# EAGLE board Display_RevA (EAGLE 6.3), part 1 of 4
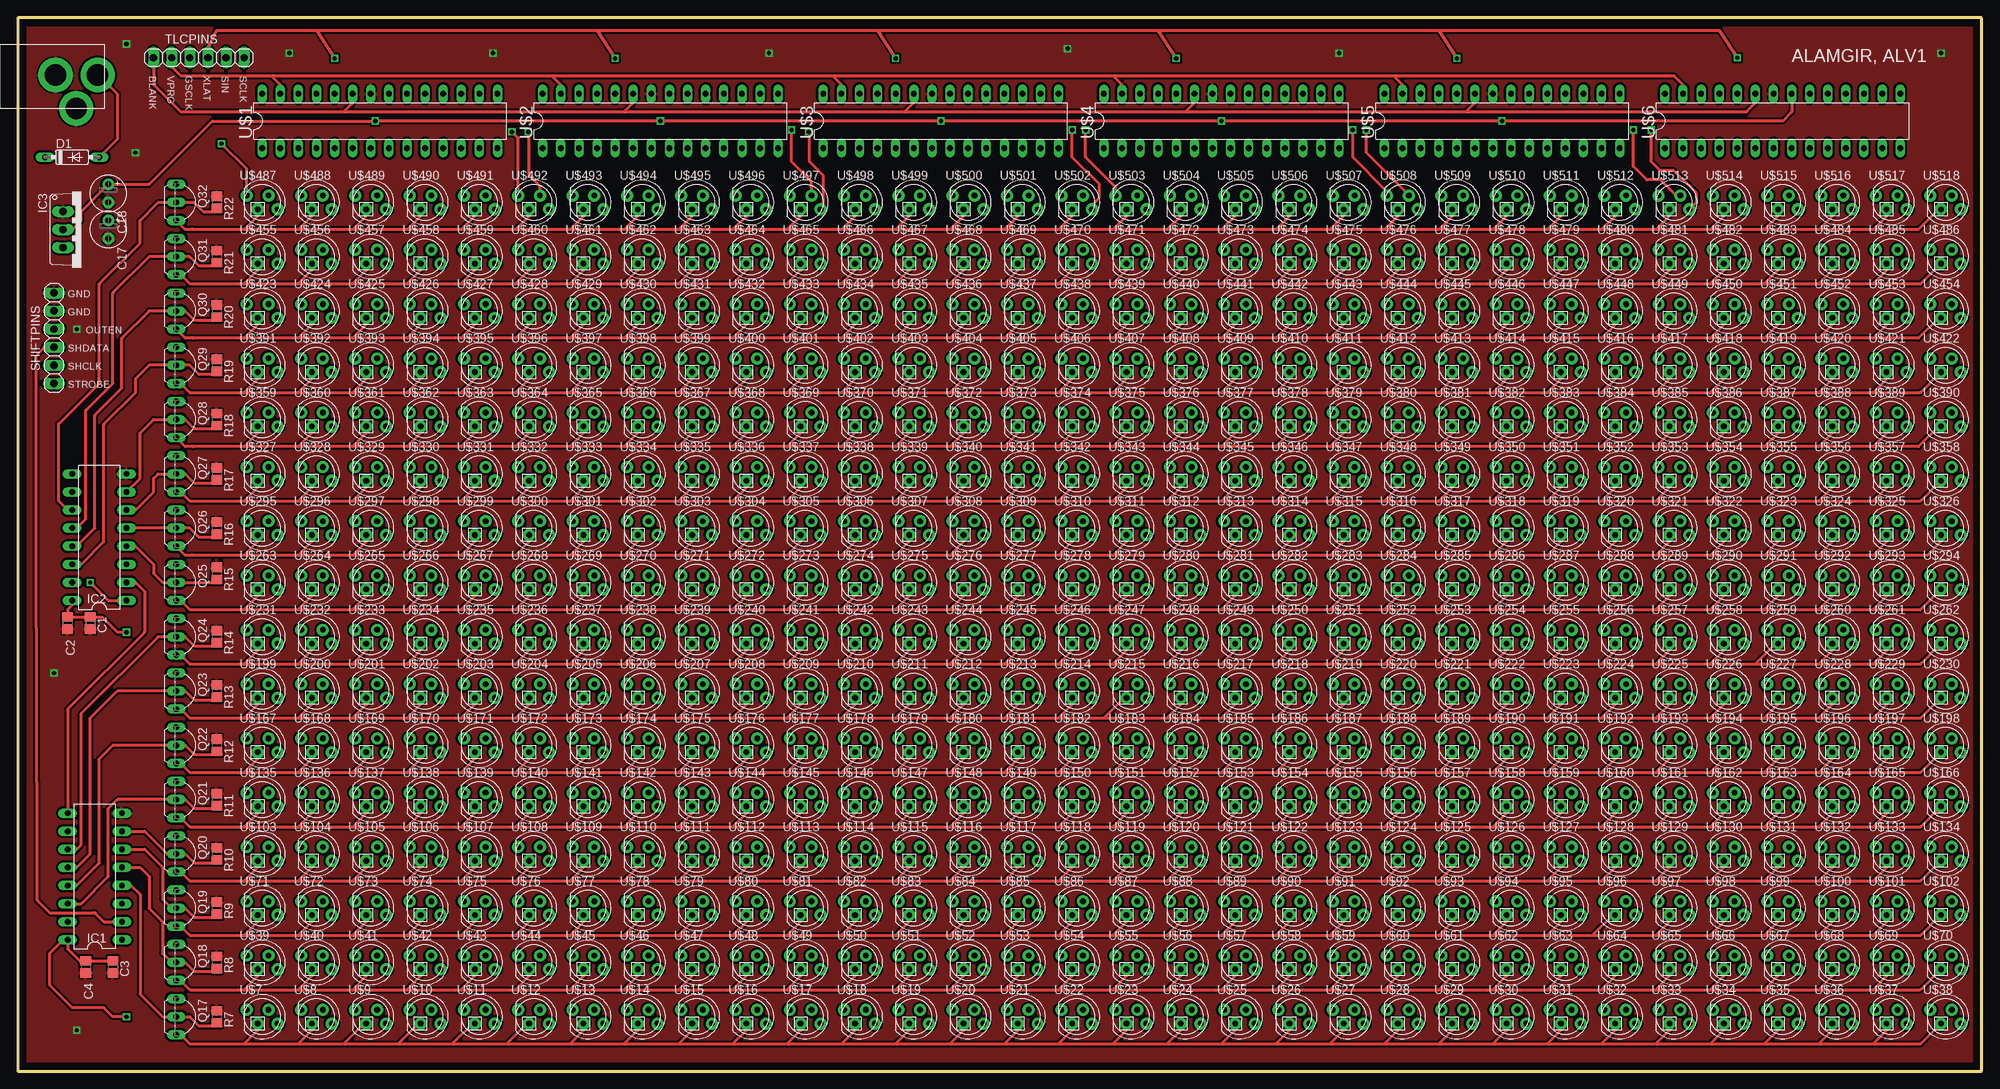
[diagram p5: board, top side]
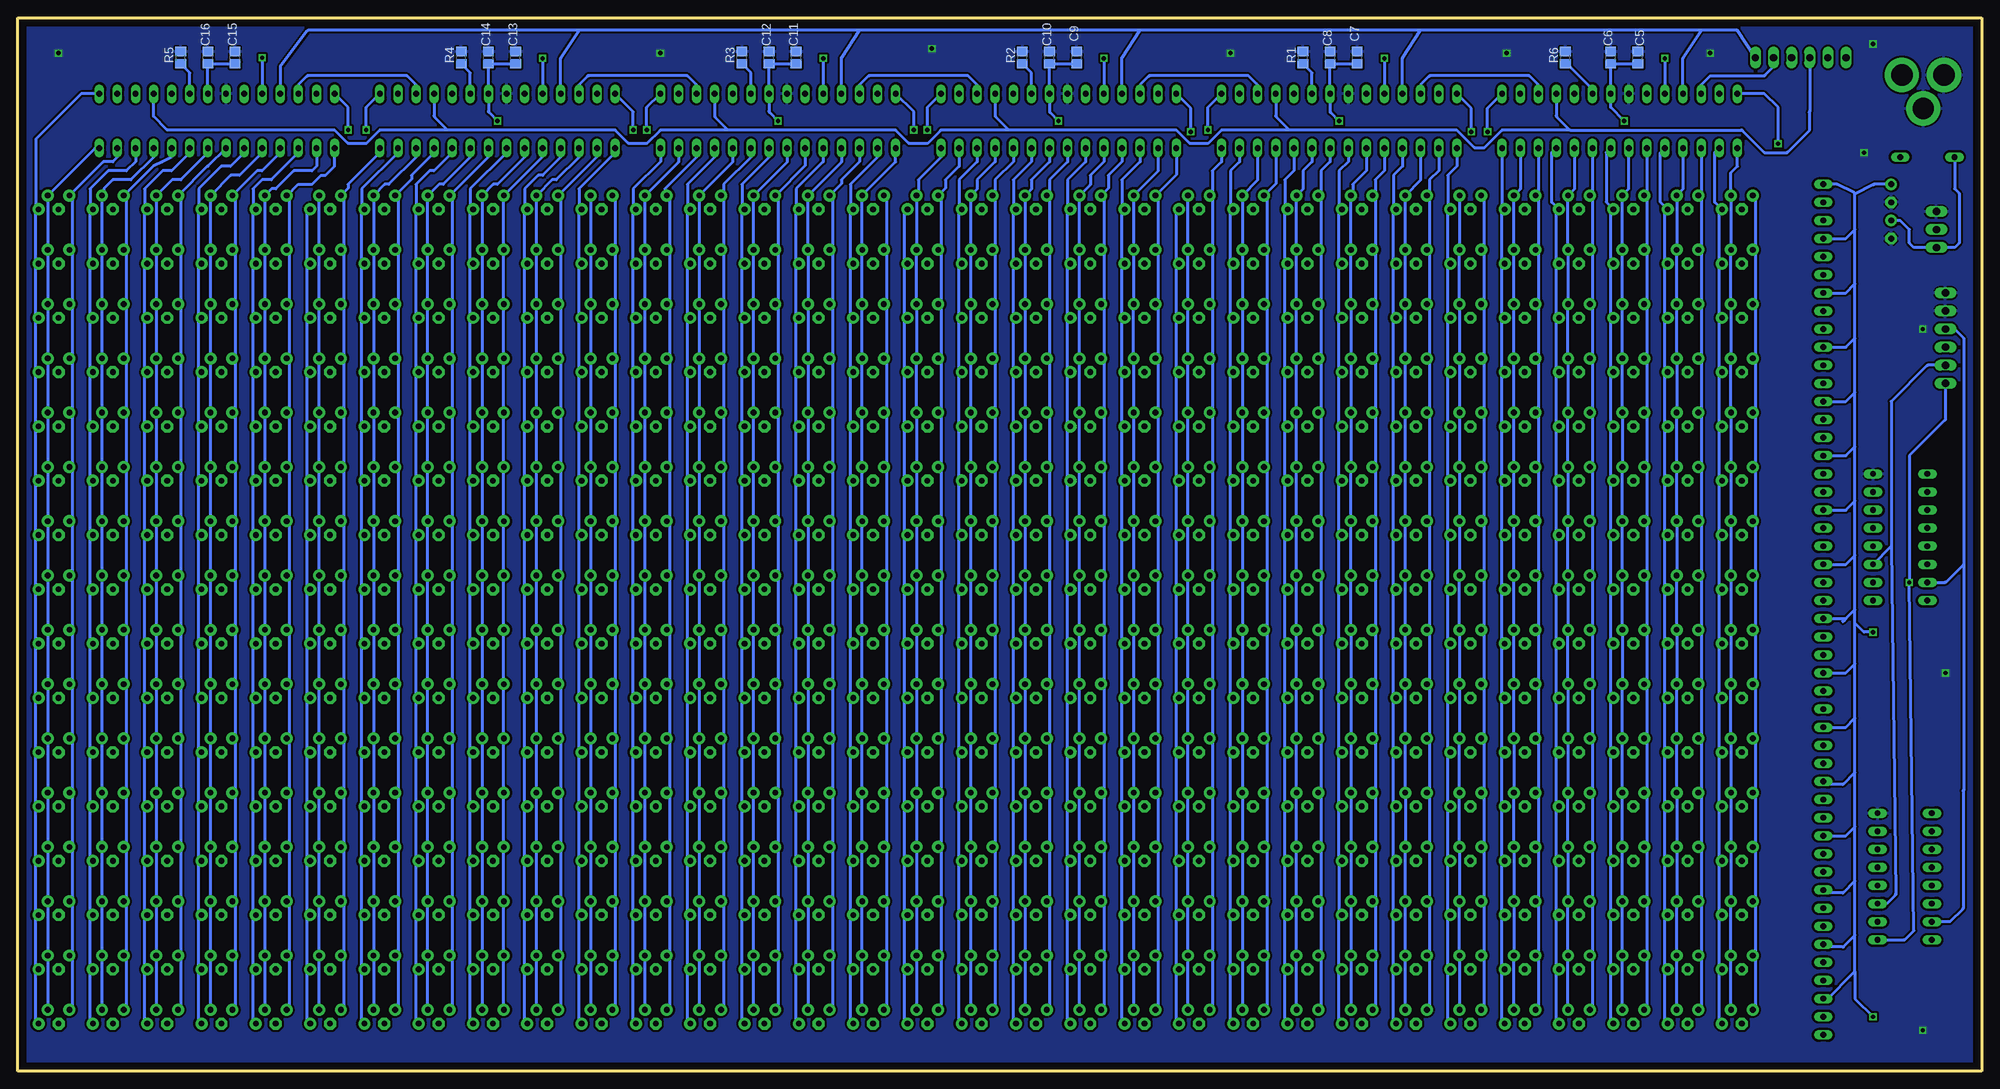
[diagram p6: board, bottom side, seen from below]

Size 275.59 x 147.83 mm. Coordinates in mm from the lower left corner, seen from the top.
Outline: 0,0 275.59,0 275.59,147.83 0,147.83 0,0
Copper layers (1*16): Top 0.035mm / dielectric 1.5mm / Bottom 0.035mm
Design rules "default": minimum track width 10mil, minimum drill 24mil, track to track 8mil, track to pad 8mil, pad to pad 8mil, via to via 8mil, smd to smd 8mil, copper to edge 40mil, drill to drill 8mil, minimum pad ring 10mil, minimum via ring 8mil, stop-mask expansion 4mil, vias tented up to drill 0mil, thermal gap 10mil
Net classes: 0 default: width 0.406 mm, drill 0.305 mm, clearance 0.305 mm

## Footprints (pad centres in the part's own frame; a part is rotated, then mirrored left to right if it is on the bottom)
C0805 = smd 1.3 x 1.5: 1 -0.85,0; 2 0.85,0
E2,5-5 = drill 0.813 pad 1.6: + -1.27,0 | drill 0.813 pad 1.6 octagon: - 1.27,0
DO35-7 = drill 0.813 long: A 3.81,0; C -3.81,0
DIL16 = drill 0.813 long: 1 -8.89,-3.81; 2 -6.35,-3.81; 3 -3.81,-3.81; 4 -1.27,-3.81; 5 1.27,-3.81; 6 3.81,-3.81; 7 6.35,-3.81; 8 8.89,-3.81; 9 8.89,3.81; 10 6.35,3.81; 11 3.81,3.81; 12 1.27,3.81; 13 -1.27,3.81; 14 -3.81,3.81; 15 -6.35,3.81; 16 -8.89,3.81
TO220V = drill 1.016 long: 1 -2.54,-2.54; 2 0,-2.54; 3 2.54,-2.54
TO92-OVAL = drill 0.813 long: 1 -2.54,0; 2 0,0; 3 2.54,0
R0805 = smd 1.3 x 1.5: 1 -0.85,0; 2 0.85,0
1X06 = drill 1.016 long: 1 -6.35,0; 2 -3.81,0; 3 -1.27,0; 4 1.27,0; 5 3.81,0; 6 6.35,0
DIL28-3 = drill 0.813 long: 1 -16.51,-3.81; 2 -13.97,-3.81; 3 -11.43,-3.81; 4 -8.89,-3.81; 5 -6.35,-3.81; 6 -3.81,-3.81; 7 -1.27,-3.81; 8 1.27,-3.81; 9 3.81,-3.81; 10 6.35,-3.81; 11 8.89,-3.81; 12 11.43,-3.81; 13 13.97,-3.81; 14 16.51,-3.81; 15 16.51,3.81; 16 13.97,3.81; 17 11.43,3.81; 18 8.89,3.81; 19 6.35,3.81; 20 3.81,3.81; 21 1.27,3.81; 22 -1.27,3.81; 23 -3.81,3.81; 24 -6.35,3.81; 25 -8.89,3.81; 26 -11.43,3.81; 27 -13.97,3.81; 28 -16.51,3.81
LED5MMRGB = drill 0.8 pad 1.676: 1 -2.159,0.968; 3 0.889,0.968; 4 2.159,-0.968 | drill 0.8 pad 1.676 octagon: 2 -0.635,-0.968
PJ-102A = drill 3 pad 4.8: RING 0.1,-3.39; RING_SW -4.6,-6.29; TIP 0.1,-9.29

## Placement (x,y rotation side)
C1  1u  [C0805]  10.16,62.86 270 top
C2  0.1u  [C0805]  6.98,62.86 270 top
C3  1u  [C0805]  13.33,14.61 270 top
C4  0.1u  [C0805]  9.53,14.61 270 top
C5  1u  [C0805]  48.26,142.24 90 bottom
C6  0.1u  [C0805]  52.07,142.24 90 bottom
C7  1u  [C0805]  87.63,142.24 90 bottom
C8  0.1u  [C0805]  91.44,142.24 90 bottom
C9  1u  [C0805]  127,142.24 90 bottom
C10  0.1u  [C0805]  130.81,142.24 90 bottom
C11  1u  [C0805]  166.37,142.24 90 bottom
C12  0.1u  [C0805]  170.18,142.24 90 bottom
C13  1u  [C0805]  205.74,142.24 90 bottom
C14  0.1u  [C0805]  209.55,142.24 90 bottom
C15  1u  [C0805]  245.11,142.24 90 bottom
C16  0.1u  [C0805]  248.92,142.24 90 bottom
C17  [E2,5-5]  12.7,118.11 270 top
C18  [E2,5-5]  12.7,123.19 270 top
D1  1N4148DO35-7  [DO35-7]  7.62,128.27 0 top
IC1  4094N  [DIL16]  10.79,27.3 90 top
IC2  4094N  [DIL16]  11.43,74.93 90 top
IC3  MC33269T-5.0  [TO220V]  8.89,118.11 270 top
Q17  PFETZVP3306  [TO92-OVAL]  22.22,7.62 270 top
Q18  PFETZVP3306  [TO92-OVAL]  22.22,15.24 270 top
Q19  PFETZVP3306  [TO92-OVAL]  22.22,22.86 270 top
Q20  PFETZVP3306  [TO92-OVAL]  22.22,30.48 270 top
Q21  PFETZVP3306  [TO92-OVAL]  22.22,38.1 270 top
Q22  PFETZVP3306  [TO92-OVAL]  22.22,45.72 270 top
Q23  PFETZVP3306  [TO92-OVAL]  22.22,53.34 270 top
Q24  PFETZVP3306  [TO92-OVAL]  22.22,60.96 270 top
Q25  PFETZVP3306  [TO92-OVAL]  22.22,68.58 270 top
Q26  PFETZVP3306  [TO92-OVAL]  22.22,76.2 270 top
Q27  PFETZVP3306  [TO92-OVAL]  22.22,83.82 270 top
Q28  PFETZVP3306  [TO92-OVAL]  22.22,91.44 270 top
Q29  PFETZVP3306  [TO92-OVAL]  22.22,99.06 270 top
Q30  PFETZVP3306  [TO92-OVAL]  22.22,106.68 270 top
Q31  PFETZVP3306  [TO92-OVAL]  22.22,114.3 270 top
Q32  PFETZVP3306  [TO92-OVAL]  22.22,121.92 270 top
R1  2.2k  [R0805]  95.25,142.24 90 bottom
R2  2.2k  [R0805]  134.62,142.24 90 bottom
R3  2.2k  [R0805]  173.99,142.24 90 bottom
R4  2.2k  [R0805]  213.36,142.24 90 bottom
R5  2.2k  [R0805]  252.73,142.24 90 bottom
R6  2.2k  [R0805]  58.42,142.24 90 bottom
R7  1k  [R0805]  27.94,7.62 270 top
R8  1k  [R0805]  27.94,15.24 270 top
R9  1k  [R0805]  27.94,22.86 270 top
R10  1k  [R0805]  27.94,30.48 270 top
R11  1k  [R0805]  27.94,38.1 270 top
R12  1k  [R0805]  27.94,45.72 270 top
R13  1k  [R0805]  27.94,53.34 270 top
R14  1k  [R0805]  27.94,60.96 270 top
R15  1k  [R0805]  27.94,69.85 270 top
R16  1k  [R0805]  27.94,76.2 270 top
R17  1k  [R0805]  27.94,83.82 270 top
R18  1k  [R0805]  27.94,91.44 270 top
R19  1k  [R0805]  27.94,99.06 270 top
R20  1k  [R0805]  27.94,106.68 270 top
R21  1k  [R0805]  27.94,114.3 270 top
R22  1k  [R0805]  27.94,121.92 270 top
SHIFTPINS  [1X06]  5.08,102.87 270 top
TLCPINS  [1X06]  25.4,142.24 180 top
U$1  TLC5940  [DIL28-3]  50.8,133.35 0 top
U$2  TLC5940  [DIL28-3]  90.17,133.35 0 top
U$3  TLC5940  [DIL28-3]  129.54,133.35 0 top
U$4  TLC5940  [DIL28-3]  168.91,133.35 0 top
U$5  TLC5940  [DIL28-3]  208.28,133.35 0 top
U$6  TLC5940  [DIL28-3]  247.65,133.35 0 top
U$7  RGBLEDAN  [LED5MMRGB]  34.29,7.62 0 top
U$8  RGBLEDAN  [LED5MMRGB]  41.91,7.62 0 top
U$9  RGBLEDAN  [LED5MMRGB]  49.53,7.62 0 top
U$10  RGBLEDAN  [LED5MMRGB]  57.15,7.62 0 top
U$11  RGBLEDAN  [LED5MMRGB]  64.77,7.62 0 top
U$12  RGBLEDAN  [LED5MMRGB]  72.39,7.62 0 top
U$13  RGBLEDAN  [LED5MMRGB]  80.01,7.62 0 top
U$14  RGBLEDAN  [LED5MMRGB]  87.63,7.62 0 top
U$15  RGBLEDAN  [LED5MMRGB]  95.25,7.62 0 top
U$16  RGBLEDAN  [LED5MMRGB]  102.87,7.62 0 top
U$17  RGBLEDAN  [LED5MMRGB]  110.49,7.62 0 top
U$18  RGBLEDAN  [LED5MMRGB]  118.11,7.62 0 top
U$19  RGBLEDAN  [LED5MMRGB]  125.73,7.62 0 top
U$20  RGBLEDAN  [LED5MMRGB]  133.35,7.62 0 top
U$21  RGBLEDAN  [LED5MMRGB]  140.97,7.62 0 top
U$22  RGBLEDAN  [LED5MMRGB]  148.59,7.62 0 top
U$23  RGBLEDAN  [LED5MMRGB]  156.21,7.62 0 top
U$24  RGBLEDAN  [LED5MMRGB]  163.83,7.62 0 top
U$25  RGBLEDAN  [LED5MMRGB]  171.45,7.62 0 top
U$26  RGBLEDAN  [LED5MMRGB]  179.07,7.62 0 top
U$27  RGBLEDAN  [LED5MMRGB]  186.69,7.62 0 top
U$28  RGBLEDAN  [LED5MMRGB]  194.31,7.62 0 top
U$29  RGBLEDAN  [LED5MMRGB]  201.93,7.62 0 top
U$30  RGBLEDAN  [LED5MMRGB]  209.55,7.62 0 top
U$31  RGBLEDAN  [LED5MMRGB]  217.17,7.62 0 top
U$32  RGBLEDAN  [LED5MMRGB]  224.79,7.62 0 top
U$33  RGBLEDAN  [LED5MMRGB]  232.41,7.62 0 top
U$34  RGBLEDAN  [LED5MMRGB]  240.03,7.62 0 top
U$35  RGBLEDAN  [LED5MMRGB]  247.65,7.62 0 top
U$36  RGBLEDAN  [LED5MMRGB]  255.27,7.62 0 top
U$37  RGBLEDAN  [LED5MMRGB]  262.89,7.62 0 top
U$38  RGBLEDAN  [LED5MMRGB]  270.51,7.62 0 top
U$39  RGBLEDAN  [LED5MMRGB]  34.29,15.24 0 top
U$40  RGBLEDAN  [LED5MMRGB]  41.91,15.24 0 top
U$41  RGBLEDAN  [LED5MMRGB]  49.53,15.24 0 top
U$42  RGBLEDAN  [LED5MMRGB]  57.15,15.24 0 top
U$43  RGBLEDAN  [LED5MMRGB]  64.77,15.24 0 top
U$44  RGBLEDAN  [LED5MMRGB]  72.39,15.24 0 top
U$45  RGBLEDAN  [LED5MMRGB]  80.01,15.24 0 top
U$46  RGBLEDAN  [LED5MMRGB]  87.63,15.24 0 top
U$47  RGBLEDAN  [LED5MMRGB]  95.25,15.24 0 top
U$48  RGBLEDAN  [LED5MMRGB]  102.87,15.24 0 top
U$49  RGBLEDAN  [LED5MMRGB]  110.49,15.24 0 top
U$50  RGBLEDAN  [LED5MMRGB]  118.11,15.24 0 top
U$51  RGBLEDAN  [LED5MMRGB]  125.73,15.24 0 top
U$52  RGBLEDAN  [LED5MMRGB]  133.35,15.24 0 top
U$53  RGBLEDAN  [LED5MMRGB]  140.97,15.24 0 top
U$54  RGBLEDAN  [LED5MMRGB]  148.59,15.24 0 top
U$55  RGBLEDAN  [LED5MMRGB]  156.21,15.24 0 top
U$56  RGBLEDAN  [LED5MMRGB]  163.83,15.24 0 top
U$57  RGBLEDAN  [LED5MMRGB]  171.45,15.24 0 top
U$58  RGBLEDAN  [LED5MMRGB]  179.07,15.24 0 top
U$59  RGBLEDAN  [LED5MMRGB]  186.69,15.24 0 top
U$60  RGBLEDAN  [LED5MMRGB]  194.31,15.24 0 top
U$61  RGBLEDAN  [LED5MMRGB]  201.93,15.24 0 top
U$62  RGBLEDAN  [LED5MMRGB]  209.55,15.24 0 top
U$63  RGBLEDAN  [LED5MMRGB]  217.17,15.24 0 top
U$64  RGBLEDAN  [LED5MMRGB]  224.79,15.24 0 top
U$65  RGBLEDAN  [LED5MMRGB]  232.41,15.24 0 top
U$66  RGBLEDAN  [LED5MMRGB]  240.03,15.24 0 top
U$67  RGBLEDAN  [LED5MMRGB]  247.65,15.24 0 top
U$68  RGBLEDAN  [LED5MMRGB]  255.27,15.24 0 top
U$69  RGBLEDAN  [LED5MMRGB]  262.89,15.24 0 top
U$70  RGBLEDAN  [LED5MMRGB]  270.51,15.24 0 top
U$71  RGBLEDAN  [LED5MMRGB]  34.29,22.86 0 top
U$72  RGBLEDAN  [LED5MMRGB]  41.91,22.86 0 top
U$73  RGBLEDAN  [LED5MMRGB]  49.53,22.86 0 top
U$74  RGBLEDAN  [LED5MMRGB]  57.15,22.86 0 top
U$75  RGBLEDAN  [LED5MMRGB]  64.77,22.86 0 top
U$76  RGBLEDAN  [LED5MMRGB]  72.39,22.86 0 top
U$77  RGBLEDAN  [LED5MMRGB]  80.01,22.86 0 top
U$78  RGBLEDAN  [LED5MMRGB]  87.63,22.86 0 top
U$79  RGBLEDAN  [LED5MMRGB]  95.25,22.86 0 top
U$80  RGBLEDAN  [LED5MMRGB]  102.87,22.86 0 top
U$81  RGBLEDAN  [LED5MMRGB]  110.49,22.86 0 top
U$82  RGBLEDAN  [LED5MMRGB]  118.11,22.86 0 top
U$83  RGBLEDAN  [LED5MMRGB]  125.73,22.86 0 top
U$84  RGBLEDAN  [LED5MMRGB]  133.35,22.86 0 top
U$85  RGBLEDAN  [LED5MMRGB]  140.97,22.86 0 top
U$86  RGBLEDAN  [LED5MMRGB]  148.59,22.86 0 top
U$87  RGBLEDAN  [LED5MMRGB]  156.21,22.86 0 top
U$88  RGBLEDAN  [LED5MMRGB]  163.83,22.86 0 top
U$89  RGBLEDAN  [LED5MMRGB]  171.45,22.86 0 top
U$90  RGBLEDAN  [LED5MMRGB]  179.07,22.86 0 top
U$91  RGBLEDAN  [LED5MMRGB]  186.69,22.86 0 top
U$92  RGBLEDAN  [LED5MMRGB]  194.31,22.86 0 top
U$93  RGBLEDAN  [LED5MMRGB]  201.93,22.86 0 top
U$94  RGBLEDAN  [LED5MMRGB]  209.55,22.86 0 top
U$95  RGBLEDAN  [LED5MMRGB]  217.17,22.86 0 top
U$96  RGBLEDAN  [LED5MMRGB]  224.79,22.86 0 top
U$97  RGBLEDAN  [LED5MMRGB]  232.41,22.86 0 top
U$98  RGBLEDAN  [LED5MMRGB]  240.03,22.86 0 top
U$99  RGBLEDAN  [LED5MMRGB]  247.65,22.86 0 top
U$100  RGBLEDAN  [LED5MMRGB]  255.27,22.86 0 top
U$101  RGBLEDAN  [LED5MMRGB]  262.89,22.86 0 top
U$102  RGBLEDAN  [LED5MMRGB]  270.51,22.86 0 top
U$103  RGBLEDAN  [LED5MMRGB]  34.29,30.48 0 top
U$104  RGBLEDAN  [LED5MMRGB]  41.91,30.48 0 top
U$105  RGBLEDAN  [LED5MMRGB]  49.53,30.48 0 top
U$106  RGBLEDAN  [LED5MMRGB]  57.15,30.48 0 top
U$107  RGBLEDAN  [LED5MMRGB]  64.77,30.48 0 top
U$108  RGBLEDAN  [LED5MMRGB]  72.39,30.48 0 top
U$109  RGBLEDAN  [LED5MMRGB]  80.01,30.48 0 top
U$110  RGBLEDAN  [LED5MMRGB]  87.63,30.48 0 top
U$111  RGBLEDAN  [LED5MMRGB]  95.25,30.48 0 top
U$112  RGBLEDAN  [LED5MMRGB]  102.87,30.48 0 top
U$113  RGBLEDAN  [LED5MMRGB]  110.49,30.48 0 top
U$114  RGBLEDAN  [LED5MMRGB]  118.11,30.48 0 top
U$115  RGBLEDAN  [LED5MMRGB]  125.73,30.48 0 top
U$116  RGBLEDAN  [LED5MMRGB]  133.35,30.48 0 top
U$117  RGBLEDAN  [LED5MMRGB]  140.97,30.48 0 top
U$118  RGBLEDAN  [LED5MMRGB]  148.59,30.48 0 top
U$119  RGBLEDAN  [LED5MMRGB]  156.21,30.48 0 top
U$120  RGBLEDAN  [LED5MMRGB]  163.83,30.48 0 top
U$121  RGBLEDAN  [LED5MMRGB]  171.45,30.48 0 top
U$122  RGBLEDAN  [LED5MMRGB]  179.07,30.48 0 top
U$123  RGBLEDAN  [LED5MMRGB]  186.69,30.48 0 top
U$124  RGBLEDAN  [LED5MMRGB]  194.31,30.48 0 top
U$125  RGBLEDAN  [LED5MMRGB]  201.93,30.48 0 top
U$126  RGBLEDAN  [LED5MMRGB]  209.55,30.48 0 top
U$127  RGBLEDAN  [LED5MMRGB]  217.17,30.48 0 top
U$128  RGBLEDAN  [LED5MMRGB]  224.79,30.48 0 top
U$129  RGBLEDAN  [LED5MMRGB]  232.41,30.48 0 top
U$130  RGBLEDAN  [LED5MMRGB]  240.03,30.48 0 top
U$131  RGBLEDAN  [LED5MMRGB]  247.65,30.48 0 top
U$132  RGBLEDAN  [LED5MMRGB]  255.27,30.48 0 top
U$133  RGBLEDAN  [LED5MMRGB]  262.89,30.48 0 top
U$134  RGBLEDAN  [LED5MMRGB]  270.51,30.48 0 top
U$135  RGBLEDAN  [LED5MMRGB]  34.29,38.1 0 top
U$136  RGBLEDAN  [LED5MMRGB]  41.91,38.1 0 top
U$137  RGBLEDAN  [LED5MMRGB]  49.53,38.1 0 top
U$138  RGBLEDAN  [LED5MMRGB]  57.15,38.1 0 top
U$139  RGBLEDAN  [LED5MMRGB]  64.77,38.1 0 top
U$140  RGBLEDAN  [LED5MMRGB]  72.39,38.1 0 top
U$141  RGBLEDAN  [LED5MMRGB]  80.01,38.1 0 top
U$142  RGBLEDAN  [LED5MMRGB]  87.63,38.1 0 top
U$143  RGBLEDAN  [LED5MMRGB]  95.25,38.1 0 top
U$144  RGBLEDAN  [LED5MMRGB]  102.87,38.1 0 top
U$145  RGBLEDAN  [LED5MMRGB]  110.49,38.1 0 top
U$146  RGBLEDAN  [LED5MMRGB]  118.11,38.1 0 top
U$147  RGBLEDAN  [LED5MMRGB]  125.73,38.1 0 top
U$148  RGBLEDAN  [LED5MMRGB]  133.35,38.1 0 top
U$149  RGBLEDAN  [LED5MMRGB]  140.97,38.1 0 top
U$150  RGBLEDAN  [LED5MMRGB]  148.59,38.1 0 top
U$151  RGBLEDAN  [LED5MMRGB]  156.21,38.1 0 top
U$152  RGBLEDAN  [LED5MMRGB]  163.83,38.1 0 top
U$153  RGBLEDAN  [LED5MMRGB]  171.45,38.1 0 top
U$154  RGBLEDAN  [LED5MMRGB]  179.07,38.1 0 top
U$155  RGBLEDAN  [LED5MMRGB]  186.69,38.1 0 top
U$156  RGBLEDAN  [LED5MMRGB]  194.31,38.1 0 top
U$157  RGBLEDAN  [LED5MMRGB]  201.93,38.1 0 top
U$158  RGBLEDAN  [LED5MMRGB]  209.55,38.1 0 top
U$159  RGBLEDAN  [LED5MMRGB]  217.17,38.1 0 top
U$160  RGBLEDAN  [LED5MMRGB]  224.79,38.1 0 top
U$161  RGBLEDAN  [LED5MMRGB]  232.41,38.1 0 top
U$162  RGBLEDAN  [LED5MMRGB]  240.03,38.1 0 top
U$163  RGBLEDAN  [LED5MMRGB]  247.65,38.1 0 top
U$164  RGBLEDAN  [LED5MMRGB]  255.27,38.1 0 top
U$165  RGBLEDAN  [LED5MMRGB]  262.89,38.1 0 top
U$166  RGBLEDAN  [LED5MMRGB]  270.51,38.1 0 top
U$167  RGBLEDAN  [LED5MMRGB]  34.29,45.72 0 top
U$168  RGBLEDAN  [LED5MMRGB]  41.91,45.72 0 top
U$169  RGBLEDAN  [LED5MMRGB]  49.53,45.72 0 top
U$170  RGBLEDAN  [LED5MMRGB]  57.15,45.72 0 top
U$171  RGBLEDAN  [LED5MMRGB]  64.77,45.72 0 top
U$172  RGBLEDAN  [LED5MMRGB]  72.39,45.72 0 top
U$173  RGBLEDAN  [LED5MMRGB]  80.01,45.72 0 top
U$174  RGBLEDAN  [LED5MMRGB]  87.63,45.72 0 top
U$175  RGBLEDAN  [LED5MMRGB]  95.25,45.72 0 top
U$176  RGBLEDAN  [LED5MMRGB]  102.87,45.72 0 top
U$177  RGBLEDAN  [LED5MMRGB]  110.49,45.72 0 top
U$178  RGBLEDAN  [LED5MMRGB]  118.11,45.72 0 top
U$179  RGBLEDAN  [LED5MMRGB]  125.73,45.72 0 top
U$180  RGBLEDAN  [LED5MMRGB]  133.35,45.72 0 top
U$181  RGBLEDAN  [LED5MMRGB]  140.97,45.72 0 top
U$182  RGBLEDAN  [LED5MMRGB]  148.59,45.72 0 top
U$183  RGBLEDAN  [LED5MMRGB]  156.21,45.72 0 top
U$184  RGBLEDAN  [LED5MMRGB]  163.83,45.72 0 top
U$185  RGBLEDAN  [LED5MMRGB]  171.45,45.72 0 top
U$186  RGBLEDAN  [LED5MMRGB]  179.07,45.72 0 top
U$187  RGBLEDAN  [LED5MMRGB]  186.69,45.72 0 top
U$188  RGBLEDAN  [LED5MMRGB]  194.31,45.72 0 top
U$189  RGBLEDAN  [LED5MMRGB]  201.93,45.72 0 top
U$190  RGBLEDAN  [LED5MMRGB]  209.55,45.72 0 top
U$191  RGBLEDAN  [LED5MMRGB]  217.17,45.72 0 top
U$192  RGBLEDAN  [LED5MMRGB]  224.79,45.72 0 top
U$193  RGBLEDAN  [LED5MMRGB]  232.41,45.72 0 top
U$194  RGBLEDAN  [LED5MMRGB]  240.03,45.72 0 top
U$195  RGBLEDAN  [LED5MMRGB]  247.65,45.72 0 top
U$196  RGBLEDAN  [LED5MMRGB]  255.27,45.72 0 top
U$197  RGBLEDAN  [LED5MMRGB]  262.89,45.72 0 top
U$198  RGBLEDAN  [LED5MMRGB]  270.51,45.72 0 top
U$199  RGBLEDAN  [LED5MMRGB]  34.29,53.34 0 top
U$200  RGBLEDAN  [LED5MMRGB]  41.91,53.34 0 top
U$201  RGBLEDAN  [LED5MMRGB]  49.53,53.34 0 top
U$202  RGBLEDAN  [LED5MMRGB]  57.15,53.34 0 top
U$203  RGBLEDAN  [LED5MMRGB]  64.77,53.34 0 top
U$204  RGBLEDAN  [LED5MMRGB]  72.39,53.34 0 top
U$205  RGBLEDAN  [LED5MMRGB]  80.01,53.34 0 top
U$206  RGBLEDAN  [LED5MMRGB]  87.63,53.34 0 top
U$207  RGBLEDAN  [LED5MMRGB]  95.25,53.34 0 top
U$208  RGBLEDAN  [LED5MMRGB]  102.87,53.34 0 top
U$209  RGBLEDAN  [LED5MMRGB]  110.49,53.34 0 top
U$210  RGBLEDAN  [LED5MMRGB]  118.11,53.34 0 top
U$211  RGBLEDAN  [LED5MMRGB]  125.73,53.34 0 top
U$212  RGBLEDAN  [LED5MMRGB]  133.35,53.34 0 top
U$213  RGBLEDAN  [LED5MMRGB]  140.97,53.34 0 top
U$214  RGBLEDAN  [LED5MMRGB]  148.59,53.34 0 top
U$215  RGBLEDAN  [LED5MMRGB]  156.21,53.34 0 top
U$216  RGBLEDAN  [LED5MMRGB]  163.83,53.34 0 top
U$217  RGBLEDAN  [LED5MMRGB]  171.45,53.34 0 top
U$218  RGBLEDAN  [LED5MMRGB]  179.07,53.34 0 top
U$219  RGBLEDAN  [LED5MMRGB]  186.69,53.34 0 top
U$220  RGBLEDAN  [LED5MMRGB]  194.31,53.34 0 top
U$221  RGBLEDAN  [LED5MMRGB]  201.93,53.34 0 top
U$222  RGBLEDAN  [LED5MMRGB]  209.55,53.34 0 top
U$223  RGBLEDAN  [LED5MMRGB]  217.17,53.34 0 top
U$224  RGBLEDAN  [LED5MMRGB]  224.79,53.34 0 top
U$225  RGBLEDAN  [LED5MMRGB]  232.41,53.34 0 top
U$226  RGBLEDAN  [LED5MMRGB]  240.03,53.34 0 top
U$227  RGBLEDAN  [LED5MMRGB]  247.65,53.34 0 top
U$228  RGBLEDAN  [LED5MMRGB]  255.27,53.34 0 top
U$229  RGBLEDAN  [LED5MMRGB]  262.89,53.34 0 top
U$230  RGBLEDAN  [LED5MMRGB]  270.51,53.34 0 top
U$231  RGBLEDAN  [LED5MMRGB]  34.29,60.96 0 top
U$232  RGBLEDAN  [LED5MMRGB]  41.91,60.96 0 top
U$233  RGBLEDAN  [LED5MMRGB]  49.53,60.96 0 top
U$234  RGBLEDAN  [LED5MMRGB]  57.15,60.96 0 top
U$235  RGBLEDAN  [LED5MMRGB]  64.77,60.96 0 top
U$236  RGBLEDAN  [LED5MMRGB]  72.39,60.96 0 top
U$237  RGBLEDAN  [LED5MMRGB]  80.01,60.96 0 top
U$238  RGBLEDAN  [LED5MMRGB]  87.63,60.96 0 top
U$239  RGBLEDAN  [LED5MMRGB]  95.25,60.96 0 top
U$240  RGBLEDAN  [LED5MMRGB]  102.87,60.96 0 top
U$241  RGBLEDAN  [LED5MMRGB]  110.49,60.96 0 top
U$242  RGBLEDAN  [LED5MMRGB]  118.11,60.96 0 top
U$243  RGBLEDAN  [LED5MMRGB]  125.73,60.96 0 top
U$244  RGBLEDAN  [LED5MMRGB]  133.35,60.96 0 top
U$245  RGBLEDAN  [LED5MMRGB]  140.97,60.96 0 top
U$246  RGBLEDAN  [LED5MMRGB]  148.59,60.96 0 top
U$247  RGBLEDAN  [LED5MMRGB]  156.21,60.96 0 top
U$248  RGBLEDAN  [LED5MMRGB]  163.83,60.96 0 top
U$249  RGBLEDAN  [LED5MMRGB]  171.45,60.96 0 top
U$250  RGBLEDAN  [LED5MMRGB]  179.07,60.96 0 top
U$251  RGBLEDAN  [LED5MMRGB]  186.69,60.96 0 top
U$252  RGBLEDAN  [LED5MMRGB]  194.31,60.96 0 top
U$253  RGBLEDAN  [LED5MMRGB]  201.93,60.96 0 top
U$254  RGBLEDAN  [LED5MMRGB]  209.55,60.96 0 top
U$255  RGBLEDAN  [LED5MMRGB]  217.17,60.96 0 top
U$256  RGBLEDAN  [LED5MMRGB]  224.79,60.96 0 top
U$257  RGBLEDAN  [LED5MMRGB]  232.41,60.96 0 top
U$258  RGBLEDAN  [LED5MMRGB]  240.03,60.96 0 top
U$259  RGBLEDAN  [LED5MMRGB]  247.65,60.96 0 top
U$260  RGBLEDAN  [LED5MMRGB]  255.27,60.96 0 top
U$261  RGBLEDAN  [LED5MMRGB]  262.89,60.96 0 top
U$262  RGBLEDAN  [LED5MMRGB]  270.51,60.96 0 top
U$263  RGBLEDAN  [LED5MMRGB]  34.29,68.58 0 top
U$264  RGBLEDAN  [LED5MMRGB]  41.91,68.58 0 top
U$265  RGBLEDAN  [LED5MMRGB]  49.53,68.58 0 top
U$266  RGBLEDAN  [LED5MMRGB]  57.15,68.58 0 top
U$267  RGBLEDAN  [LED5MMRGB]  64.77,68.58 0 top
U$268  RGBLEDAN  [LED5MMRGB]  72.39,68.58 0 top
U$269  RGBLEDAN  [LED5MMRGB]  80.01,68.58 0 top
U$270  RGBLEDAN  [LED5MMRGB]  87.63,68.58 0 top
U$271  RGBLEDAN  [LED5MMRGB]  95.25,68.58 0 top
U$272  RGBLEDAN  [LED5MMRGB]  102.87,68.58 0 top
U$273  RGBLEDAN  [LED5MMRGB]  110.49,68.58 0 top
U$274  RGBLEDAN  [LED5MMRGB]  118.11,68.58 0 top
U$275  RGBLEDAN  [LED5MMRGB]  125.73,68.58 0 top
U$276  RGBLEDAN  [LED5MMRGB]  133.35,68.58 0 top
U$277  RGBLEDAN  [LED5MMRGB]  140.97,68.58 0 top
U$278  RGBLEDAN  [LED5MMRGB]  148.59,68.58 0 top
U$279  RGBLEDAN  [LED5MMRGB]  156.21,68.58 0 top
U$280  RGBLEDAN  [LED5MMRGB]  163.83,68.58 0 top
U$281  RGBLEDAN  [LED5MMRGB]  171.45,68.58 0 top
U$282  RGBLEDAN  [LED5MMRGB]  179.07,68.58 0 top
U$283  RGBLEDAN  [LED5MMRGB]  186.69,68.58 0 top
U$284  RGBLEDAN  [LED5MMRGB]  194.31,68.58 0 top
U$285  RGBLEDAN  [LED5MMRGB]  201.93,68.58 0 top
U$286  RGBLEDAN  [LED5MMRGB]  209.55,68.58 0 top
U$287  RGBLEDAN  [LED5MMRGB]  217.17,68.58 0 top
U$288  RGBLEDAN  [LED5MMRGB]  224.79,68.58 0 top
U$289  RGBLEDAN  [LED5MMRGB]  232.41,68.58 0 top
U$290  RGBLEDAN  [LED5MMRGB]  240.03,68.58 0 top
U$291  RGBLEDAN  [LED5MMRGB]  247.65,68.58 0 top
U$292  RGBLEDAN  [LED5MMRGB]  255.27,68.58 0 top
U$293  RGBLEDAN  [LED5MMRGB]  262.89,68.58 0 top
U$294  RGBLEDAN  [LED5MMRGB]  270.51,68.58 0 top
U$295  RGBLEDAN  [LED5MMRGB]  34.29,76.2 0 top
U$296  RGBLEDAN  [LED5MMRGB]  41.91,76.2 0 top
U$297  RGBLEDAN  [LED5MMRGB]  49.53,76.2 0 top
U$298  RGBLEDAN  [LED5MMRGB]  57.15,76.2 0 top
U$299  RGBLEDAN  [LED5MMRGB]  64.77,76.2 0 top
U$300  RGBLEDAN  [LED5MMRGB]  72.39,76.2 0 top
U$301  RGBLEDAN  [LED5MMRGB]  80.01,76.2 0 top
U$302  RGBLEDAN  [LED5MMRGB]  87.63,76.2 0 top
U$303  RGBLEDAN  [LED5MMRGB]  95.25,76.2 0 top
U$304  RGBLEDAN  [LED5MMRGB]  102.87,76.2 0 top
U$305  RGBLEDAN  [LED5MMRGB]  110.49,76.2 0 top
U$306  RGBLEDAN  [LED5MMRGB]  118.11,76.2 0 top
U$307  RGBLEDAN  [LED5MMRGB]  125.73,76.2 0 top
U$308  RGBLEDAN  [LED5MMRGB]  133.35,76.2 0 top
U$309  RGBLEDAN  [LED5MMRGB]  140.97,76.2 0 top
U$310  RGBLEDAN  [LED5MMRGB]  148.59,76.2 0 top
U$311  RGBLEDAN  [LED5MMRGB]  156.21,76.2 0 top
U$312  RGBLEDAN  [LED5MMRGB]  163.83,76.2 0 top
U$313  RGBLEDAN  [LED5MMRGB]  171.45,76.2 0 top
U$314  RGBLEDAN  [LED5MMRGB]  179.07,76.2 0 top
U$315  RGBLEDAN  [LED5MMRGB]  186.69,76.2 0 top
U$316  RGBLEDAN  [LED5MMRGB]  194.31,76.2 0 top
U$317  RGBLEDAN  [LED5MMRGB]  201.93,76.2 0 top
U$318  RGBLEDAN  [LED5MMRGB]  209.55,76.2 0 top
U$319  RGBLEDAN  [LED5MMRGB]  217.17,76.2 0 top
U$320  RGBLEDAN  [LED5MMRGB]  224.79,76.2 0 top
U$321  RGBLEDAN  [LED5MMRGB]  232.41,76.2 0 top
U$322  RGBLEDAN  [LED5MMRGB]  240.03,76.2 0 top
U$323  RGBLEDAN  [LED5MMRGB]  247.65,76.2 0 top
U$324  RGBLEDAN  [LED5MMRGB]  255.27,76.2 0 top
U$325  RGBLEDAN  [LED5MMRGB]  262.89,76.2 0 top
U$326  RGBLEDAN  [LED5MMRGB]  270.51,76.2 0 top
U$327  RGBLEDAN  [LED5MMRGB]  34.29,83.82 0 top
U$328  RGBLEDAN  [LED5MMRGB]  41.91,83.82 0 top
U$329  RGBLEDAN  [LED5MMRGB]  49.53,83.82 0 top
U$330  RGBLEDAN  [LED5MMRGB]  57.15,83.82 0 top
U$331  RGBLEDAN  [LED5MMRGB]  64.77,83.82 0 top
U$332  RGBLEDAN  [LED5MMRGB]  72.39,83.82 0 top
U$333  RGBLEDAN  [LED5MMRGB]  80.01,83.82 0 top
U$334  RGBLEDAN  [LED5MMRGB]  87.63,83.82 0 top
U$335  RGBLEDAN  [LED5MMRGB]  95.25,83.82 0 top
U$336  RGBLEDAN  [LED5MMRGB]  102.87,83.82 0 top
U$337  RGBLEDAN  [LED5MMRGB]  110.49,83.82 0 top
U$338  RGBLEDAN  [LED5MMRGB]  118.11,83.82 0 top
U$339  RGBLEDAN  [LED5MMRGB]  125.73,83.82 0 top
U$340  RGBLEDAN  [LED5MMRGB]  133.35,83.82 0 top
U$341  RGBLEDAN  [LED5MMRGB]  140.97,83.82 0 top
U$342  RGBLEDAN  [LED5MMRGB]  148.59,83.82 0 top
U$343  RGBLEDAN  [LED5MMRGB]  156.21,83.82 0 top
U$344  RGBLEDAN  [LED5MMRGB]  163.83,83.82 0 top
U$345  RGBLEDAN  [LED5MMRGB]  171.45,83.82 0 top
U$346  RGBLEDAN  [LED5MMRGB]  179.07,83.82 0 top
U$347  RGBLEDAN  [LED5MMRGB]  186.69,83.82 0 top
U$348  RGBLEDAN  [LED5MMRGB]  194.31,83.82 0 top
U$349  RGBLEDAN  [LED5MMRGB]  201.93,83.82 0 top
U$350  RGBLEDAN  [LED5MMRGB]  209.55,83.82 0 top
U$351  RGBLEDAN  [LED5MMRGB]  217.17,83.82 0 top
U$352  RGBLEDAN  [LED5MMRGB]  224.79,83.82 0 top
U$353  RGBLEDAN  [LED5MMRGB]  232.41,83.82 0 top
U$354  RGBLEDAN  [LED5MMRGB]  240.03,83.82 0 top
U$355  RGBLEDAN  [LED5MMRGB]  247.65,83.82 0 top
U$356  RGBLEDAN  [LED5MMRGB]  255.27,83.82 0 top
U$357  RGBLEDAN  [LED5MMRGB]  262.89,83.82 0 top
U$358  RGBLEDAN  [LED5MMRGB]  270.51,83.82 0 top
U$359  RGBLEDAN  [LED5MMRGB]  34.29,91.44 0 top
U$360  RGBLEDAN  [LED5MMRGB]  41.91,91.44 0 top
U$361  RGBLEDAN  [LED5MMRGB]  49.53,91.44 0 top
U$362  RGBLEDAN  [LED5MMRGB]  57.15,91.44 0 top
U$363  RGBLEDAN  [LED5MMRGB]  64.77,91.44 0 top
U$364  RGBLEDAN  [LED5MMRGB]  72.39,91.44 0 top
U$365  RGBLEDAN  [LED5MMRGB]  80.01,91.44 0 top
U$366  RGBLEDAN  [LED5MMRGB]  87.63,91.44 0 top
U$367  RGBLEDAN  [LED5MMRGB]  95.25,91.44 0 top
U$368  RGBLEDAN  [LED5MMRGB]  102.87,91.44 0 top
U$369  RGBLEDAN  [LED5MMRGB]  110.49,91.44 0 top
U$370  RGBLEDAN  [LED5MMRGB]  118.11,91.44 0 top
U$371  RGBLEDAN  [LED5MMRGB]  125.73,91.44 0 top
U$372  RGBLEDAN  [LED5MMRGB]  133.35,91.44 0 top
U$373  RGBLEDAN  [LED5MMRGB]  140.97,91.44 0 top
U$374  RGBLEDAN  [LED5MMRGB]  148.59,91.44 0 top
U$375  RGBLEDAN  [LED5MMRGB]  156.21,91.44 0 top
U$376  RGBLEDAN  [LED5MMRGB]  163.83,91.44 0 top
U$377  RGBLEDAN  [LED5MMRGB]  171.45,91.44 0 top
U$378  RGBLEDAN  [LED5MMRGB]  179.07,91.44 0 top
U$379  RGBLEDAN  [LED5MMRGB]  186.69,91.44 0 top
U$380  RGBLEDAN  [LED5MMRGB]  194.31,91.44 0 top
U$381  RGBLEDAN  [LED5MMRGB]  201.93,91.44 0 top
U$382  RGBLEDAN  [LED5MMRGB]  209.55,91.44 0 top
U$383  RGBLEDAN  [LED5MMRGB]  217.17,91.44 0 top
U$384  RGBLEDAN  [LED5MMRGB]  224.79,91.44 0 top
U$385  RGBLEDAN  [LED5MMRGB]  232.41,91.44 0 top
U$386  RGBLEDAN  [LED5MMRGB]  240.03,91.44 0 top
U$387  RGBLEDAN  [LED5MMRGB]  247.65,91.44 0 top
U$388  RGBLEDAN  [LED5MMRGB]  255.27,91.44 0 top
U$389  RGBLEDAN  [LED5MMRGB]  262.89,91.44 0 top
U$390  RGBLEDAN  [LED5MMRGB]  270.51,91.44 0 top
U$391  RGBLEDAN  [LED5MMRGB]  34.29,99.06 0 top
U$392  RGBLEDAN  [LED5MMRGB]  41.91,99.06 0 top
U$393  RGBLEDAN  [LED5MMRGB]  49.53,99.06 0 top
U$394  RGBLEDAN  [LED5MMRGB]  57.15,99.06 0 top
U$395  RGBLEDAN  [LED5MMRGB]  64.77,99.06 0 top
U$396  RGBLEDAN  [LED5MMRGB]  72.39,99.06 0 top
U$397  RGBLEDAN  [LED5MMRGB]  80.01,99.06 0 top
U$398  RGBLEDAN  [LED5MMRGB]  87.63,99.06 0 top
U$399  RGBLEDAN  [LED5MMRGB]  95.25,99.06 0 top
U$400  RGBLEDAN  [LED5MMRGB]  102.87,99.06 0 top
U$401  RGBLEDAN  [LED5MMRGB]  110.49,99.06 0 top
U$402  RGBLEDAN  [LED5MMRGB]  118.11,99.06 0 top
U$403  RGBLEDAN  [LED5MMRGB]  125.73,99.06 0 top
U$404  RGBLEDAN  [LED5MMRGB]  133.35,99.06 0 top
U$405  RGBLEDAN  [LED5MMRGB]  140.97,99.06 0 top
U$406  RGBLEDAN  [LED5MMRGB]  148.59,99.06 0 top
U$407  RGBLEDAN  [LED5MMRGB]  156.21,99.06 0 top
U$408  RGBLEDAN  [LED5MMRGB]  163.83,99.06 0 top
U$409  RGBLEDAN  [LED5MMRGB]  171.45,99.06 0 top
U$410  RGBLEDAN  [LED5MMRGB]  179.07,99.06 0 top
U$411  RGBLEDAN  [LED5MMRGB]  186.69,99.06 0 top
U$412  RGBLEDAN  [LED5MMRGB]  194.31,99.06 0 top
U$413  RGBLEDAN  [LED5MMRGB]  201.93,99.06 0 top
U$414  RGBLEDAN  [LED5MMRGB]  209.55,99.06 0 top
U$415  RGBLEDAN  [LED5MMRGB]  217.17,99.06 0 top
U$416  RGBLEDAN  [LED5MMRGB]  224.79,99.06 0 top
U$417  RGBLEDAN  [LED5MMRGB]  232.41,99.06 0 top
U$418  RGBLEDAN  [LED5MMRGB]  240.03,99.06 0 top
U$419  RGBLEDAN  [LED5MMRGB]  247.65,99.06 0 top
U$420  RGBLEDAN  [LED5MMRGB]  255.27,99.06 0 top
U$421  RGBLEDAN  [LED5MMRGB]  262.89,99.06 0 top
U$422  RGBLEDAN  [LED5MMRGB]  270.51,99.06 0 top
U$423  RGBLEDAN  [LED5MMRGB]  34.29,106.68 0 top
U$424  RGBLEDAN  [LED5MMRGB]  41.91,106.68 0 top
U$425  RGBLEDAN  [LED5MMRGB]  49.53,106.68 0 top
U$426  RGBLEDAN  [LED5MMRGB]  57.15,106.68 0 top
U$427  RGBLEDAN  [LED5MMRGB]  64.77,106.68 0 top
U$428  RGBLEDAN  [LED5MMRGB]  72.39,106.68 0 top
U$429  RGBLEDAN  [LED5MMRGB]  80.01,106.68 0 top
U$430  RGBLEDAN  [LED5MMRGB]  87.63,106.68 0 top
U$431  RGBLEDAN  [LED5MMRGB]  95.25,106.68 0 top
U$432  RGBLEDAN  [LED5MMRGB]  102.87,106.68 0 top
U$433  RGBLEDAN  [LED5MMRGB]  110.49,106.68 0 top
U$434  RGBLEDAN  [LED5MMRGB]  118.11,106.68 0 top
U$435  RGBLEDAN  [LED5MMRGB]  125.73,106.68 0 top
U$436  RGBLEDAN  [LED5MMRGB]  133.35,106.68 0 top
U$437  RGBLEDAN  [LED5MMRGB]  140.97,106.68 0 top
U$438  RGBLEDAN  [LED5MMRGB]  148.59,106.68 0 top
U$439  RGBLEDAN  [LED5MMRGB]  156.21,106.68 0 top
U$440  RGBLEDAN  [LED5MMRGB]  163.83,106.68 0 top
U$441  RGBLEDAN  [LED5MMRGB]  171.45,106.68 0 top
U$442  RGBLEDAN  [LED5MMRGB]  179.07,106.68 0 top
U$443  RGBLEDAN  [LED5MMRGB]  186.69,106.68 0 top
U$444  RGBLEDAN  [LED5MMRGB]  194.31,106.68 0 top
U$445  RGBLEDAN  [LED5MMRGB]  201.93,106.68 0 top
U$446  RGBLEDAN  [LED5MMRGB]  209.55,106.68 0 top
U$447  RGBLEDAN  [LED5MMRGB]  217.17,106.68 0 top
U$448  RGBLEDAN  [LED5MMRGB]  224.79,106.68 0 top
U$449  RGBLEDAN  [LED5MMRGB]  232.41,106.68 0 top
U$450  RGBLEDAN  [LED5MMRGB]  240.03,106.68 0 top
U$451  RGBLEDAN  [LED5MMRGB]  247.65,106.68 0 top
U$452  RGBLEDAN  [LED5MMRGB]  255.27,106.68 0 top
U$453  RGBLEDAN  [LED5MMRGB]  262.89,106.68 0 top
U$454  RGBLEDAN  [LED5MMRGB]  270.51,106.68 0 top
U$455  RGBLEDAN  [LED5MMRGB]  34.29,114.3 0 top
U$456  RGBLEDAN  [LED5MMRGB]  41.91,114.3 0 top
U$457  RGBLEDAN  [LED5MMRGB]  49.53,114.3 0 top
U$458  RGBLEDAN  [LED5MMRGB]  57.15,114.3 0 top
U$459  RGBLEDAN  [LED5MMRGB]  64.77,114.3 0 top
U$460  RGBLEDAN  [LED5MMRGB]  72.39,114.3 0 top
U$461  RGBLEDAN  [LED5MMRGB]  80.01,114.3 0 top
U$462  RGBLEDAN  [LED5MMRGB]  87.63,114.3 0 top
U$463  RGBLEDAN  [LED5MMRGB]  95.25,114.3 0 top
U$464  RGBLEDAN  [LED5MMRGB]  102.87,114.3 0 top
U$465  RGBLEDAN  [LED5MMRGB]  110.49,114.3 0 top
U$466  RGBLEDAN  [LED5MMRGB]  118.11,114.3 0 top
U$467  RGBLEDAN  [LED5MMRGB]  125.73,114.3 0 top
U$468  RGBLEDAN  [LED5MMRGB]  133.35,114.3 0 top
U$469  RGBLEDAN  [LED5MMRGB]  140.97,114.3 0 top
U$470  RGBLEDAN  [LED5MMRGB]  148.59,114.3 0 top
U$471  RGBLEDAN  [LED5MMRGB]  156.21,114.3 0 top
U$472  RGBLEDAN  [LED5MMRGB]  163.83,114.3 0 top
U$473  RGBLEDAN  [LED5MMRGB]  171.45,114.3 0 top
U$474  RGBLEDAN  [LED5MMRGB]  179.07,114.3 0 top
U$475  RGBLEDAN  [LED5MMRGB]  186.69,114.3 0 top
U$476  RGBLEDAN  [LED5MMRGB]  194.31,114.3 0 top
U$477  RGBLEDAN  [LED5MMRGB]  201.93,114.3 0 top
U$478  RGBLEDAN  [LED5MMRGB]  209.55,114.3 0 top
U$479  RGBLEDAN  [LED5MMRGB]  217.17,114.3 0 top
U$480  RGBLEDAN  [LED5MMRGB]  224.79,114.3 0 top
U$481  RGBLEDAN  [LED5MMRGB]  232.41,114.3 0 top
U$482  RGBLEDAN  [LED5MMRGB]  240.03,114.3 0 top
U$483  RGBLEDAN  [LED5MMRGB]  247.65,114.3 0 top
U$484  RGBLEDAN  [LED5MMRGB]  255.27,114.3 0 top
U$485  RGBLEDAN  [LED5MMRGB]  262.89,114.3 0 top
U$486  RGBLEDAN  [LED5MMRGB]  270.51,114.3 0 top
U$487  RGBLEDAN  [LED5MMRGB]  34.29,121.92 0 top
U$488  RGBLEDAN  [LED5MMRGB]  41.91,121.92 0 top
U$489  RGBLEDAN  [LED5MMRGB]  49.53,121.92 0 top
U$490  RGBLEDAN  [LED5MMRGB]  57.15,121.92 0 top
U$491  RGBLEDAN  [LED5MMRGB]  64.77,121.92 0 top
U$492  RGBLEDAN  [LED5MMRGB]  72.39,121.92 0 top
U$493  RGBLEDAN  [LED5MMRGB]  80.01,121.92 0 top
U$494  RGBLEDAN  [LED5MMRGB]  87.63,121.92 0 top
U$495  RGBLEDAN  [LED5MMRGB]  95.25,121.92 0 top
U$496  RGBLEDAN  [LED5MMRGB]  102.87,121.92 0 top
U$497  RGBLEDAN  [LED5MMRGB]  110.49,121.92 0 top
U$498  RGBLEDAN  [LED5MMRGB]  118.11,121.92 0 top
U$499  RGBLEDAN  [LED5MMRGB]  125.73,121.92 0 top
U$500  RGBLEDAN  [LED5MMRGB]  133.35,121.92 0 top
U$501  RGBLEDAN  [LED5MMRGB]  140.97,121.92 0 top
U$502  RGBLEDAN  [LED5MMRGB]  148.59,121.92 0 top
U$503  RGBLEDAN  [LED5MMRGB]  156.21,121.92 0 top
U$504  RGBLEDAN  [LED5MMRGB]  163.83,121.92 0 top
U$505  RGBLEDAN  [LED5MMRGB]  171.45,121.92 0 top
U$506  RGBLEDAN  [LED5MMRGB]  179.07,121.92 0 top
U$507  RGBLEDAN  [LED5MMRGB]  186.69,121.92 0 top
U$508  RGBLEDAN  [LED5MMRGB]  194.31,121.92 0 top
U$509  RGBLEDAN  [LED5MMRGB]  201.93,121.92 0 top
U$510  RGBLEDAN  [LED5MMRGB]  209.55,121.92 0 top
U$511  RGBLEDAN  [LED5MMRGB]  217.17,121.92 0 top
U$512  RGBLEDAN  [LED5MMRGB]  224.79,121.92 0 top
U$513  RGBLEDAN  [LED5MMRGB]  232.41,121.92 0 top
U$514  RGBLEDAN  [LED5MMRGB]  240.03,121.92 0 top
U$515  RGBLEDAN  [LED5MMRGB]  247.65,121.92 0 top
U$516  RGBLEDAN  [LED5MMRGB]  255.27,121.92 0 top
U$517  RGBLEDAN  [LED5MMRGB]  262.89,121.92 0 top
U$518  RGBLEDAN  [LED5MMRGB]  270.51,121.92 0 top
U$519  2.1MMJACKTHM  [PJ-102A]  1.91,139.7 90 top

## Tracks (layer width: path | path; a pad name or v marks a point on that pad's centre or on a via)
+5V  (via drill 0.6)
  Top 0.406: U$6.21 248.92,134.72 arc-45 248.85,134.55 247.65,133.35 v208.28,133.35 v168.91,133.35 v129.54,133.35 v90.17,133.35 v50.17,133.35 27.3,133.35 18.49,124.53 arc-45 18.31,124.46 C18.+ 8.89,120.65 8.89,119.38 7.62,118.11 IC3.2 | C3.1 C4.1 9.31,15.24 8.89,15.24 6.98,17.15 IC1.16 6.35,18.41 4.45,16.51 4.45,12.07 7.62,8.89 12.06,8.89 13.33,7.62 v15.24,7.62 | IC2.16 7.62,65.41 6.98,64.77 C2.1 C1.1 11.85,63.72 13.97,61.59 v15.24,61.59
  Bottom 0.406: 17.78,13.97 21.9,9.85 arc45 22.08,9.78 22.22,9.93 Q17.1 | 17.78,13.97 17.78,19.05 | 17.78,19.05 17.78,26.67 | 17.78,26.67 17.78,34.29 | 17.78,34.29 17.78,41.91 | 17.78,41.91 17.78,49.53 | 17.78,49.53 17.78,57.15 | 17.78,57.15 17.78,62.86 | 17.78,62.86 17.78,64.77 | 17.78,64.77 17.78,72.39 | 17.78,72.39 17.78,80.01 | 17.78,80.01 17.78,87.63 | 17.78,87.63 17.78,95.25 | 17.78,95.25 17.78,102.87 | 17.78,102.87 17.78,110.49 | 17.78,110.49 17.78,118.11 | 17.78,118.11 17.78,123.08 | 17.78,123.08 arc-45 17.85,123.26 20.32,124.46 Q32.1 | Q32.1 22.37,124.46 arc-45 22.55,124.39 22.48,124.46 Q32.1 | C18.+ 15.03,124.46 arc-45 15.21,124.39 17.78,123.08 | 17.78,110.49 19.05,109.22 Q30.1 | 17.78,102.87 19.05,101.6 Q29.1 | 17.78,95.25 19.05,93.98 Q28.1 | 17.78,87.63 19.05,86.36 Q27.1 | 17.78,80.01 19.05,78.74 Q26.1 | 19.54,63.12 arc-45 19.36,63.19 19.05,63.5 | 19.05,63.5 17.78,64.77 | 17.78,57.15 19.05,55.88 Q23.1 | 17.78,49.53 19.05,48.26 Q22.1 | 17.78,41.91 19.36,40.33 arc45 19.54,40.26 21.84,40.26 Q21.1 | 17.78,34.29 19.05,33.02 Q20.1 | 17.78,26.67 19.36,25.09 arc45 19.54,25.02 21.84,25.02 Q19.1 | 17.78,19.05 19.36,17.47 arc45 19.54,17.4 21.84,17.4 Q18.1 | v50.17,133.35 52.07,135.25 U$1.21 C6.1 C5.1 | v90.17,133.35 91.37,134.55 arc45 91.44,134.72 U$2.21 C8.1 C7.1 | v129.54,133.35 130.74,134.55 arc45 130.81,134.72 U$3.21 C10.1 C9.1 | v168.91,133.35 170.11,134.55 arc45 170.18,134.72 U$4.21 C12.1 C11.1 | v208.28,133.35 209.48,134.55 arc45 209.55,134.72 U$5.21 C14.1 C13.1 | 17.78,13.97 17.78,10.16 v15.24,7.62 | v15.24,61.59 16.51,61.59 17.78,62.86 | U$6.21 C16.1 C15.1 | C15.1 244.69,141.39 244.48,141.61 244.9,141.61 C15.1
  Bottom 0.406: Q24.1 19.05,63.5 | Q25.1 19.05,71.12 17.78,72.39 | Q31.1 19.05,116.84 17.78,118.11
BLANK
  Top 0.406: TLCPINS.6 19.05,138.53 arc45 19.12,138.36 22.86,134.62 45.72,134.62 | 45.72,134.62 85.09,134.62 | 85.09,134.62 124.46,134.62 | 124.46,134.62 163.83,134.62 | 163.83,134.62 203.2,134.62 | 203.2,134.62 242.47,134.62 arc45 242.64,134.69 243.84,135.89 U$6.23 | U$5.23 204.47,136 arc-45 204.4,135.82 203.2,134.62 | U$4.23 165.1,136 arc-45 165.03,135.82 163.83,134.62 | U$3.23 125.73,136 arc-45 125.66,135.82 124.46,134.62 | U$2.23 86.36,136 arc-45 86.29,135.82 85.09,134.62 | U$1.23 46.99,136 arc-45 46.92,135.82 45.72,134.62
GND  (via drill 0.6)
  other vias: 147.32,143.51 185.42,142.88 105.41,142.88 66.67,142.88 38.1,142.88 15.24,144.15 16.51,128.91 8.26,104.14 5.08,55.88 8.26,5.71 269.88,142.88
  pour Top: -3.81,151.13 -10.16,151.13 -10.16,1.27 283.21,1.27 283.21,151.13
  pour Bottom: -10.16,151.13 -10.16,1.27 283.21,1.27 283.21,151.13
GSCLK
  Bottom 0.406: TLCPINS.4 24.13,134.72 | 24.13,134.72 arc45 24.2,134.55 | 57.79,132.08 67.2,132.08 arc-45 67.38,132.01 69.85,129.54 71.02,129.54 arc45 71.19,129.61 73.66,132.08 97.16,132.08 | 97.16,132.08 106.58,132.08 arc-45 106.75,132.01 108.58,130.18 111.02,130.18 arc45 111.2,130.25 113.03,132.08 136.53,132.08 | 136.53,132.08 145.95,132.08 arc-45 146.12,132.01 147.96,130.18 150.39,130.18 arc45 150.57,130.25 152.4,132.08 175.9,132.08 | 175.9,132.08 185.31,132.08 arc-45 185.49,132.01 187.33,130.18 189.76,130.18 arc45 189.94,130.25 191.77,132.08 215.27,132.08 | 215.27,132.08 224.69,132.08 arc-45 224.86,132.01 226.7,130.18 229.13,130.18 arc45 229.31,130.25 231.14,132.08 254.53,132.08 arc45 254.71,132.15 256.54,133.99 U$6.18 | U$5.18 217.17,134.09 arc-45 217.1,133.91 215.27,132.08 | U$4.18 177.8,134.09 arc-45 177.73,133.91 175.9,132.08 | U$3.18 138.43,134.09 arc-45 138.36,133.91 136.53,132.08 | U$2.18 99.06,134.09 arc-45 98.99,133.91 97.16,132.08 | U$1.18 59.69,134.09 arc-45 59.62,133.91 57.79,132.08 | 57.79,132.08 33.76,132.08 arc45 33.58,132.01 30.48,128.91 27.41,128.91 arc-45 27.23,128.98 24.13,132.08 24.13,134.72
N$1
  Top 0.406: IC1.5 17.14,28.58 18.41,27.3 18.41,22.86 20.32,20.96 20.32,16.51 21.59,15.24 Q18.2 23.5,15.24 24.77,13.97 27.52,13.97 R8.2
N$2
  Top 0.406: 31.75,11.43 24.13,11.43 22.93,12.63 arc-45 22.86,12.81 22.75,12.7 Q18.3 | 31.75,11.43 39.37,11.43 | 39.37,11.43 46.99,11.43 | 46.99,11.43 54.61,11.43 | 54.61,11.43 62.23,11.43 | 62.23,11.43 69.85,11.43 | 69.85,11.43 77.47,11.43 | 77.47,11.43 85.09,11.43 | 85.09,11.43 92.71,11.43 | 92.71,11.43 100.33,11.43 | 100.33,11.43 107.95,11.43 | 107.95,11.43 115.57,11.43 | 115.57,11.43 123.19,11.43 | 123.19,11.43 130.81,11.43 | 130.81,11.43 138.43,11.43 | 138.43,11.43 146.05,11.43 | 146.05,11.43 153.67,11.43 | 153.67,11.43 161.29,11.43 | 161.29,11.43 168.91,11.43 | 168.91,11.43 176.53,11.43 | 176.53,11.43 184.15,11.43 | 184.15,11.43 191.77,11.43 | 191.77,11.43 199.39,11.43 | 199.39,11.43 207.01,11.43 | 207.01,11.43 214.63,11.43 | 214.63,11.43 222.25,11.43 | 222.25,11.43 229.87,11.43 | 229.87,11.43 237.49,11.43 | 237.49,11.43 245.11,11.43 | 245.11,11.43 252.73,11.43 | 252.73,11.43 260.35,11.43 | 260.35,11.43 266.93,11.43 arc45 267.11,11.5 U$70.2 | U$52.2 132.72,13.44 arc-45 132.64,13.26 130.81,11.43 | U$51.2 125.09,13.44 arc-45 125.02,13.26 123.19,11.43 | U$50.2 117.47,13.44 arc-45 117.4,13.26 115.57,11.43 | U$49.2 109.85,13.44 arc-45 109.78,13.26 107.95,11.43 | U$48.2 102.23,13.44 arc-45 102.16,13.26 100.33,11.43 | U$47.2 94.61,13.44 arc-45 94.54,13.26 92.71,11.43 | U$46.2 86.99,13.44 arc-45 86.92,13.26 85.09,11.43 | U$45.2 79.38,13.44 arc-45 79.3,13.26 77.47,11.43 | U$44.2 71.75,13.44 arc-45 71.68,13.26 69.85,11.43 | U$43.2 64.14,13.44 arc-45 64.06,13.26 62.23,11.43 | U$42.2 56.52,13.44 arc-45 56.44,13.26 54.61,11.43 | U$41.2 48.9,13.44 arc-45 48.82,13.26 46.99,11.43 | U$40.2 41.28,13.44 arc-45 41.2,13.26 39.37,11.43
  Top 0.406: U$39.2 33.66,13.44 arc-45 33.58,13.26 31.75,11.43 | U$53.2 140.34,13.44 arc-45 140.26,13.26 138.43,11.43 | U$54.2 147.96,13.44 arc-45 147.88,13.26 146.05,11.43 | U$55.2 155.58,13.44 arc-45 155.5,13.26 153.67,11.43 | U$56.2 163.2,13.44 arc-45 163.12,13.26 161.29,11.43 | U$57.2 170.81,13.44 arc-45 170.74,13.26 168.91,11.43 | U$58.2 178.44,13.44 arc-45 178.36,13.26 176.53,11.43 | U$59.2 186.06,13.44 arc-45 185.98,13.26 184.15,11.43 | U$60.2 193.68,13.44 arc-45 193.6,13.26 191.77,11.43 | U$61.2 201.3,13.44 arc-45 201.22,13.26 199.39,11.43 | U$62.2 208.92,13.44 arc-45 208.84,13.26 207.01,11.43 | U$63.2 216.53,13.44 arc-45 216.46,13.26 214.63,11.43 | U$64.2 224.16,13.44 arc-45 224.08,13.26 222.25,11.43 | U$65.2 231.78,13.44 arc-45 231.7,13.26 229.87,11.43 | U$66.2 239.4,13.44 arc-45 239.32,13.26 237.49,11.43 | U$67.2 247.02,13.44 arc-45 246.94,13.26 245.11,11.43 | U$68.2 254.64,13.44 arc-45 254.56,13.26 252.73,11.43 | U$69.2 262.25,13.44 arc-45 262.18,13.26 260.35,11.43
N$3
  Top 0.406: IC1.6 17.78,31.12 20.32,28.58 20.32,24.13 21.59,22.86 Q19.2 23.5,22.86 24.77,21.59 27.52,21.59 R9.2
N$4
  Top 0.406: 22.86,20.43 arc45 22.93,20.25 | 22.93,20.25 24.13,19.05 31.75,19.05 | 31.75,19.05 39.37,19.05 | 39.37,19.05 46.99,19.05 | 46.99,19.05 54.61,19.05 | 54.61,19.05 62.23,19.05 | 62.23,19.05 69.85,19.05 | 69.85,19.05 77.47,19.05 | 77.47,19.05 85.09,19.05 | 85.09,19.05 92.71,19.05 | 92.71,19.05 100.33,19.05 | 100.33,19.05 107.95,19.05 | 107.95,19.05 115.57,19.05 | 115.57,19.05 123.19,19.05 | 123.19,19.05 130.81,19.05 | 130.81,19.05 138.43,19.05 | 138.43,19.05 146.05,19.05 | 146.05,19.05 153.67,19.05 | 153.67,19.05 161.29,19.05 | 161.29,19.05 168.91,19.05 | 168.91,19.05 176.53,19.05 | 176.53,19.05 184.15,19.05 | 184.15,19.05 191.77,19.05 | 191.77,19.05 199.39,19.05 | 199.39,19.05 207.01,19.05 | 207.01,19.05 214.63,19.05 | 214.63,19.05 220.98,19.05 | 220.98,19.05 229.87,19.05 | 229.87,19.05 237.49,19.05 | 237.49,19.05 245.11,19.05 | 245.11,19.05 252.73,19.05 | 252.73,19.05 260.35,19.05 | 260.35,19.05 266.93,19.05 arc45 267.11,19.12 U$102.2 | U$71.2 33.66,21.06 arc-45 33.58,20.88 31.75,19.05 | U$72.2 41.28,21.06 arc-45 41.2,20.88 39.37,19.05 | U$73.2 48.9,21.06 arc-45 48.82,20.88 46.99,19.05 | U$74.2 56.52,21.06 arc-45 56.44,20.88 54.61,19.05 | U$75.2 64.14,21.06 arc-45 64.06,20.88 62.23,19.05 | U$76.2 71.75,21.06 arc-45 71.68,20.88 69.85,19.05 | U$77.2 79.38,21.06 arc-45 79.3,20.88 77.47,19.05 | U$78.2 86.99,21.06 arc-45 86.92,20.88 85.09,19.05 | U$79.2 94.61,21.06 arc-45 94.54,20.88 92.71,19.05 | U$80.2 102.23,21.06 arc-45 102.16,20.88 100.33,19.05 | U$81.2 109.85,21.06 arc-45 109.78,20.88 107.95,19.05 | U$82.2 117.47,21.06 arc-45 117.4,20.88 115.57,19.05 | U$83.2 125.09,21.06 arc-45 125.02,20.88 123.19,19.05 | U$84.2 132.72,21.06 arc-45 132.64,20.88 130.81,19.05
  Top 0.406: U$98.2 239.4,21.06 arc-45 239.32,20.88 237.49,19.05 | U$97.2 231.78,21.06 arc-45 231.7,20.88 229.87,19.05 | U$96.2 223.93,21.89 arc45 223.75,21.82 220.98,19.05 | U$95.2 216.53,21.06 arc-45 216.46,20.88 214.63,19.05 | U$94.2 208.92,21.06 arc-45 208.84,20.88 207.01,19.05 | U$93.2 201.3,21.06 arc-45 201.22,20.88 199.39,19.05 | U$92.2 193.68,21.06 arc-45 193.6,20.88 191.77,19.05 | U$91.2 186.06,21.06 arc-45 185.98,20.88 184.15,19.05 | U$90.2 178.44,21.06 arc-45 178.36,20.88 176.53,19.05 | U$89.2 170.81,21.06 arc-45 170.74,20.88 168.91,19.05 | U$88.2 163.2,21.06 arc-45 163.12,20.88 161.29,19.05 | U$87.2 155.58,21.06 arc-45 155.5,20.88 153.67,19.05 | U$86.2 147.96,21.06 arc-45 147.88,20.88 146.05,19.05 | U$85.2 140.34,21.06 arc-45 140.26,20.88 138.43,19.05 | U$101.2 262.25,21.06 arc-45 262.18,20.88 260.35,19.05 | U$99.2 247.02,21.06 arc-45 246.94,20.88 245.11,19.05 | U$100.2 254.64,21.06 arc-45 254.56,20.88 252.73,19.05 | Q19.3 22.86,20.32 22.93,20.25
N$5
  Top 0.406: IC1.7 17.78,33.66 20.95,30.48 Q20.2 23.5,30.48 24.77,29.21 27.52,29.21 R10.2
N$6
  Top 0.406: 31.75,26.67 24.13,26.67 22.93,27.87 arc-45 22.86,28.05 22.75,27.94 Q20.3 | 31.75,26.67 39.37,26.67 | 39.37,26.67 46.99,26.67 | 46.99,26.67 54.61,26.67 | 54.61,26.67 62.23,26.67 | 62.23,26.67 69.85,26.67 | 69.85,26.67 77.47,26.67 | 77.47,26.67 85.09,26.67 | 85.09,26.67 92.71,26.67 | 92.71,26.67 100.33,26.67 | 100.33,26.67 107.95,26.67 | 107.95,26.67 115.57,26.67 | 115.57,26.67 123.19,26.67 | 123.19,26.67 130.81,26.67 | 130.81,26.67 138.43,26.67 | 138.43,26.67 146.05,26.67 | 146.05,26.67 153.67,26.67 | 153.67,26.67 161.29,26.67 | 161.29,26.67 168.91,26.67 | 168.91,26.67 176.53,26.67 | 176.53,26.67 184.15,26.67 | 184.15,26.67 191.77,26.67 | 191.77,26.67 199.39,26.67 | 199.39,26.67 207.01,26.67 | 207.01,26.67 214.63,26.67 | 214.63,26.67 222.25,26.67 | 222.25,26.67 229.87,26.67 | 229.87,26.67 237.49,26.67 | 237.49,26.67 245.11,26.67 | 245.11,26.67 252.73,26.67 | 252.73,26.67 260.35,26.67 | 260.35,26.67 266.93,26.67 arc45 267.11,26.74 U$134.2 | U$116.2 132.72,28.68 arc-45 132.64,28.5 130.81,26.67 | U$115.2 125.09,28.68 arc-45 125.02,28.5 123.19,26.67 | U$114.2 117.47,28.68 arc-45 117.4,28.5 115.57,26.67 | U$113.2 109.85,28.68 arc-45 109.78,28.5 107.95,26.67 | U$112.2 102.23,28.68 arc-45 102.16,28.5 100.33,26.67 | U$111.2 94.61,28.68 arc-45 94.54,28.5 92.71,26.67 | U$110.2 86.99,28.68 arc-45 86.92,28.5 85.09,26.67 | U$109.2 79.38,28.68 arc-45 79.3,28.5 77.47,26.67 | U$108.2 71.75,28.68 arc-45 71.68,28.5 69.85,26.67 | U$107.2 64.14,28.68 arc-45 64.06,28.5 62.23,26.67 | U$106.2 56.52,28.68 arc-45 56.44,28.5 54.61,26.67 | U$105.2 48.9,28.68 arc-45 48.82,28.5 46.99,26.67 | U$104.2 41.28,28.68 arc-45 41.2,28.5 39.37,26.67
  Top 0.406: U$103.2 33.66,28.68 arc-45 33.58,28.5 31.75,26.67 | U$117.2 140.34,28.68 arc-45 140.26,28.5 138.43,26.67 | U$118.2 147.96,28.68 arc-45 147.88,28.5 146.05,26.67 | U$119.2 155.58,28.68 arc-45 155.5,28.5 153.67,26.67 | U$120.2 163.2,28.68 arc-45 163.12,28.5 161.29,26.67 | U$121.2 170.81,28.68 arc-45 170.74,28.5 168.91,26.67 | U$122.2 178.44,28.68 arc-45 178.36,28.5 176.53,26.67 | U$123.2 186.06,28.68 arc-45 185.98,28.5 184.15,26.67 | U$124.2 193.68,28.68 arc-45 193.6,28.5 191.77,26.67 | U$125.2 201.3,28.68 arc-45 201.22,28.5 199.39,26.67 | U$126.2 208.92,28.68 arc-45 208.84,28.5 207.01,26.67 | U$127.2 216.53,28.68 arc-45 216.46,28.5 214.63,26.67 | U$128.2 224.16,28.68 arc-45 224.08,28.5 222.25,26.67 | U$129.2 231.78,28.68 arc-45 231.7,28.5 229.87,26.67 | U$130.2 239.4,28.68 arc-45 239.32,28.5 237.49,26.67 | U$131.2 247.02,28.68 arc-45 246.94,28.5 245.11,26.67 | U$132.2 254.64,28.68 arc-45 254.56,28.5 252.73,26.67 | U$133.2 262.25,28.68 arc-45 262.18,28.5 260.35,26.67
N$7
  Top 0.406: IC1.14 8.89,23.5 12.7,27.3 12.7,36.83 13.97,38.1 Q21.2 23.5,38.1 24.77,36.83 27.52,36.83 R11.2
N$8
  Top 0.406: 22.86,35.66 arc45 22.93,35.49 | 22.93,35.49 24.13,34.29 31.75,34.29 | 31.75,34.29 39.37,34.29 | 39.37,34.29 46.99,34.29 | 46.99,34.29 54.61,34.29 | 54.61,34.29 62.23,34.29 | 62.23,34.29 69.85,34.29 | 69.85,34.29 77.47,34.29 | 77.47,34.29 85.09,34.29 | 85.09,34.29 92.71,34.29 | 92.71,34.29 100.33,34.29 | 100.33,34.29 107.95,34.29 | 107.95,34.29 115.57,34.29 | 115.57,34.29 123.19,34.29 | 123.19,34.29 130.81,34.29 | 130.81,34.29 138.43,34.29 | 138.43,34.29 146.05,34.29 | 146.05,34.29 153.67,34.29 | 153.67,34.29 161.29,34.29 | 161.29,34.29 168.91,34.29 | 168.91,34.29 176.53,34.29 | 176.53,34.29 184.15,34.29 | 184.15,34.29 191.77,34.29 | 191.77,34.29 199.39,34.29 | 199.39,34.29 207.01,34.29 | 207.01,34.29 214.63,34.29 | 214.63,34.29 222.25,34.29 | 222.25,34.29 229.87,34.29 | 229.87,34.29 237.49,34.29 | 237.49,34.29 245.11,34.29 | 245.11,34.29 252.73,34.29 | 252.73,34.29 260.35,34.29 | 260.35,34.29 266.93,34.29 arc45 267.11,34.36 U$166.2 | U$135.2 33.66,36.3 arc-45 33.58,36.12 31.75,34.29 | U$136.2 41.28,36.3 arc-45 41.2,36.12 39.37,34.29 | U$137.2 48.9,36.3 arc-45 48.82,36.12 46.99,34.29 | U$138.2 56.52,36.3 arc-45 56.44,36.12 54.61,34.29 | U$139.2 64.14,36.3 arc-45 64.06,36.12 62.23,34.29 | U$140.2 71.75,36.3 arc-45 71.68,36.12 69.85,34.29 | U$141.2 79.38,36.3 arc-45 79.3,36.12 77.47,34.29 | U$142.2 86.99,36.3 arc-45 86.92,36.12 85.09,34.29 | U$143.2 94.61,36.3 arc-45 94.54,36.12 92.71,34.29 | U$144.2 102.23,36.3 arc-45 102.16,36.12 100.33,34.29 | U$145.2 109.85,36.3 arc-45 109.78,36.12 107.95,34.29 | U$146.2 117.47,36.3 arc-45 117.4,36.12 115.57,34.29 | U$147.2 125.09,36.3 arc-45 125.02,36.12 123.19,34.29 | U$148.2 132.72,36.3 arc-45 132.64,36.12 130.81,34.29
  Top 0.406: U$162.2 239.4,36.3 arc-45 239.32,36.12 237.49,34.29 | U$161.2 231.78,36.3 arc-45 231.7,36.12 229.87,34.29 | U$160.2 224.16,36.3 arc-45 224.08,36.12 222.25,34.29 | U$159.2 216.53,36.3 arc-45 216.46,36.12 214.63,34.29 | U$158.2 208.92,36.3 arc-45 208.84,36.12 207.01,34.29 | U$157.2 201.3,36.3 arc-45 201.22,36.12 199.39,34.29 | U$156.2 193.68,36.3 arc-45 193.6,36.12 191.77,34.29 | U$155.2 186.06,36.3 arc-45 185.98,36.12 184.15,34.29 | U$154.2 178.44,36.3 arc-45 178.36,36.12 176.53,34.29 | U$153.2 170.81,36.3 arc-45 170.74,36.12 168.91,34.29 | U$152.2 163.2,36.3 arc-45 163.12,36.12 161.29,34.29 | U$151.2 155.58,36.3 arc-45 155.5,36.12 153.67,34.29 | U$150.2 147.96,36.3 arc-45 147.88,36.12 146.05,34.29 | U$149.2 140.34,36.3 arc-45 140.26,36.12 138.43,34.29 | U$165.2 262.25,36.3 arc-45 262.18,36.12 260.35,34.29 | U$164.2 254.64,36.3 arc-45 254.56,36.12 252.73,34.29 | U$163.2 247.02,36.3 arc-45 246.94,36.12 245.11,34.29 | Q21.3 22.86,35.56 22.93,35.49
N$9
  Top 0.406: IC1.13 8.26,26.04 11.43,29.21 11.43,43.81 13.33,45.72 Q22.2 23.5,45.72 24.77,44.45 28.36,44.45 | 28.57,44.45 28.36,44.45 | 28.36,44.45 R12.2
N$10
  Top 0.406: 31.75,41.91 24.13,41.91 22.93,43.11 arc-45 22.86,43.29 22.75,43.18 Q22.3 | 31.75,41.91 39.37,41.91 | 39.37,41.91 46.99,41.91 | 46.99,41.91 54.61,41.91 | 54.61,41.91 62.23,41.91 | 62.23,41.91 69.85,41.91 | 69.85,41.91 77.47,41.91 | 77.47,41.91 85.09,41.91 | 85.09,41.91 92.71,41.91 | 92.71,41.91 100.33,41.91 | 100.33,41.91 107.95,41.91 | 107.95,41.91 115.57,41.91 | 115.57,41.91 123.19,41.91 | 123.19,41.91 130.81,41.91 | 130.81,41.91 138.43,41.91 | 138.43,41.91 146.05,41.91 | 146.05,41.91 153.67,41.91 | 153.67,41.91 161.29,41.91 | 161.29,41.91 168.91,41.91 | 168.91,41.91 176.53,41.91 | 176.53,41.91 184.15,41.91 | 184.15,41.91 191.77,41.91 | 191.77,41.91 199.39,41.91 | 199.39,41.91 207.01,41.91 | 207.01,41.91 214.63,41.91 | 214.63,41.91 222.25,41.91 | 222.25,41.91 229.87,41.91 | 229.87,41.91 237.49,41.91 | 237.49,41.91 245.11,41.91 | 245.11,41.91 252.73,41.91 | 252.73,41.91 260.35,41.91 | 260.35,41.91 266.93,41.91 arc45 267.11,41.98 U$198.2 | U$180.2 132.72,43.92 arc-45 132.64,43.74 130.81,41.91 | U$179.2 125.09,43.92 arc-45 125.02,43.74 123.19,41.91 | U$178.2 117.47,43.92 arc-45 117.4,43.74 115.57,41.91 | U$177.2 109.85,43.92 arc-45 109.78,43.74 107.95,41.91 | U$176.2 102.23,43.92 arc-45 102.16,43.74 100.33,41.91 | U$175.2 94.61,43.92 arc-45 94.54,43.74 92.71,41.91 | U$174.2 86.99,43.92 arc-45 86.92,43.74 85.09,41.91 | U$173.2 79.38,43.92 arc-45 79.3,43.74 77.47,41.91 | U$172.2 71.75,43.92 arc-45 71.68,43.74 69.85,41.91 | U$171.2 64.14,43.92 arc-45 64.06,43.74 62.23,41.91 | U$170.2 56.52,43.92 arc-45 56.44,43.74 54.61,41.91 | U$169.2 48.9,43.92 arc-45 48.82,43.74 46.99,41.91 | U$168.2 41.28,43.92 arc-45 41.2,43.74 39.37,41.91
  Top 0.406: U$167.2 33.66,43.92 arc-45 33.58,43.74 31.75,41.91 | U$181.2 140.34,43.92 arc-45 140.26,43.74 138.43,41.91 | U$182.2 147.96,43.92 arc-45 147.88,43.74 146.05,41.91 | U$183.2 155.58,43.92 arc-45 155.5,43.74 153.67,41.91 | U$184.2 163.2,43.92 arc-45 163.12,43.74 161.29,41.91 | U$185.2 170.81,43.92 arc-45 170.74,43.74 168.91,41.91 | U$186.2 178.44,43.92 arc-45 178.36,43.74 176.53,41.91 | U$187.2 186.06,43.92 arc-45 185.98,43.74 184.15,41.91 | U$188.2 193.68,43.92 arc-45 193.6,43.74 191.77,41.91 | U$189.2 201.3,43.92 arc-45 201.22,43.74 199.39,41.91 | U$190.2 208.92,43.92 arc-45 208.84,43.74 207.01,41.91 | U$191.2 216.53,43.92 arc-45 216.46,43.74 214.63,41.91 | U$192.2 224.16,43.92 arc-45 224.08,43.74 222.25,41.91 | U$193.2 231.78,43.92 arc-45 231.7,43.74 229.87,41.91 | U$194.2 239.4,43.92 arc-45 239.32,43.74 237.49,41.91 | U$195.2 247.02,43.92 arc-45 246.94,43.74 245.11,41.91 | U$196.2 254.64,43.92 arc-45 254.56,43.74 252.73,41.91 | U$197.2 262.25,43.92 arc-45 262.18,43.74 260.35,41.91
N$11
  Top 0.406: IC1.12 8.26,28.58 10.16,30.48 10.16,49.53 13.97,53.34 Q23.2 23.5,53.34 24.77,52.07 27.52,52.07 R13.2
N$12